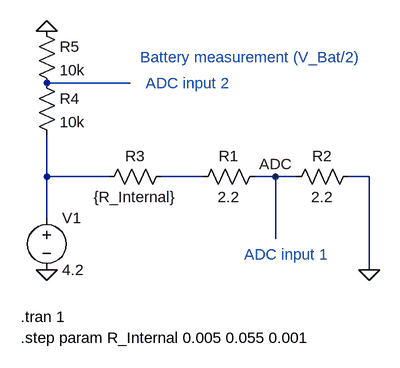
[diagram p0: schematic Resistance_tester.asc]
Resistance_tester.asc, the LTspice schematic file:
Version 4.1
SHEET 1 880 680
WIRE 208 -80 80 -80
WIRE 80 64 80 0
WIRE 176 64 80 64
WIRE 320 64 256 64
WIRE 432 64 400 64
WIRE 464 64 432 64
WIRE 576 64 544 64
WIRE 80 128 80 64
WIRE 432 160 432 64
WIRE 576 208 576 64
FLAG 576 208 0
FLAG 80 208 0
FLAG 432 64 ADC
FLAG 80 -160 0
SYMBOL voltage 80 112 R0
WINDOW 123 0 0 Left 0
WINDOW 39 0 0 Left 0
SYMATTR InstName V1
SYMATTR Value 4.2
SYMBOL res 304 80 R270
WINDOW 0 32 56 VTop 2
WINDOW 3 0 56 VBottom 2
SYMATTR InstName R1
SYMATTR Value 2.2
SYMBOL res 448 80 R270
WINDOW 0 32 56 VTop 2
WINDOW 3 0 56 VBottom 2
SYMATTR InstName R2
SYMATTR Value 2.2
SYMBOL res 160 80 R270
WINDOW 0 32 56 VTop 2
WINDOW 3 0 56 VBottom 2
SYMATTR InstName R3
SYMATTR Value {R_Internal}
SYMBOL res 64 -96 R0
SYMATTR InstName R4
SYMATTR Value 10k
SYMBOL res 64 -176 R0
SYMATTR InstName R5
SYMATTR Value 10k
TEXT 40 312 Left 2 !.step param R_Internal 0.005 0.055 0.001
TEXT 40 280 Left 2 !.tran 1
TEXT 384 184 Left 2 ;ADC input 1
TEXT 224 -120 Left 2 ;Battery measurement (V_Bat/2)
TEXT 232 -80 Left 2 ;ADC input 2

The netlist it stands for:
* Resistance_tester.asc
V1 N002 0 4.2
R1 N003 ADC 2.2
R2 ADC 0 2.2
R3 N002 N003 {R_Internal}
R4 N001 N002 10k
R5 0 N001 10k
.step param R_Internal 0.005 0.055 0.001
.tran 1
* ADC input 1
* Battery measurement (V_Bat/2)
* ADC input 2
.backanno
.end